# Altium project STM32F103C8T6.PrjPcb
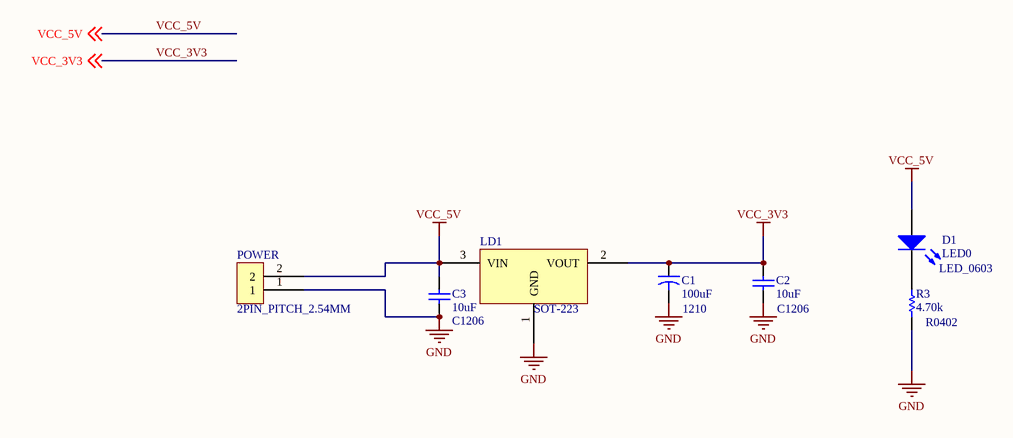
[diagram p0: 01 POWER.SchDoc]
3 sheets, 48 parts. Net scope: global (net labels, ports and power ports of the same name join across sheets).
Board file: STM32FC8T6.PcbDoc
Sheets:
  01 POWER.SchDoc
  02 CPU STM32F103C8T6.SchDoc
  04 MP_SIGNAL.SchDoc

## Sheet 01 POWER.SchDoc
size A4

### Parts
C1  100uF  [1210]
C2  10uF  [C1206]
C3  10uF  [C1206]
D1  LED0  [LED_0603]
LD1  SOT-223  [LD1117S33TR]
POWER  2PIN_PITCH_2.54MM  [2PIN_PITCH_2.54MM]
R3  4.70k  [R0402]

### Nets
GND: C1.2 C2.1 C3.1 LD1.1(GND) POWER.1 R3.2
VCC_3V3: C1.1 C2.2 LD1.2(VOUT) ; off-sheet VCC_3V3
VCC_5V: C3.2 D1.1(A) LD1.3(VIN) POWER.2 ; off-sheet VCC_5V
NetD1_2: D1.2(K) R3.1

### Library data of the parts
C1 = Cap2: Capacitor; Value: 100pF; Published: 23-Sep-2002; PackageReference: CAPR5-4X5; Publisher: Altium Limited; PackageDescription: Capacitor; 2 Leads
C2 = Cap: Capacitor; Value: 100pF; Published: 8-Jun-2000; LatestRevisionDate: 17-Jul-2002; LatestRevisionNote: Re-released for DXP Platform.; PackageReference: RAD-0.3; Publisher: Altium Limited; PackageDescription: Radial Cap, Thru-Hole; 2 Leads; 0.3 in Pin Spacing
C3 = Cap: Capacitor; Published: 8-Jun-2000; LatestRevisionDate: 17-Jul-2002; LatestRevisionNote: Re-released for DXP Platform.; PackageReference: C1206; Publisher: Altium Limited; PackageDescription: Radial Cap, Thru-Hole; 2 Leads; 0.3 in Pin Spacing
D1 = LED0: Typical INFRARED GaAs LED; Published: 8-Jun-2000; LatestRevisionDate: 08-Jul-2005; LatestRevisionNote: Mech Layer 1 removed.; PackageReference: LED-0; Publisher: Altium Limited; PackageDescription: LED; 2 Leads; footpriint: LED_0603
LD1 = LD1117S33TR
R3 = Res1: Resistor; Value: 1K; Published: 8-Jun-2000; LatestRevisionDate: 17-Jul-2002; LatestRevisionNote: Re-released for DXP Platform.; PackageReference: AXIAL-0.3; Publisher: Altium Limited; PackageDescription: Axial Device, Thru-Hole; 2 Leads; 0.3 in Pin Spacing

## Sheet 02 CPU STM32F103C8T6.SchDoc
size A4
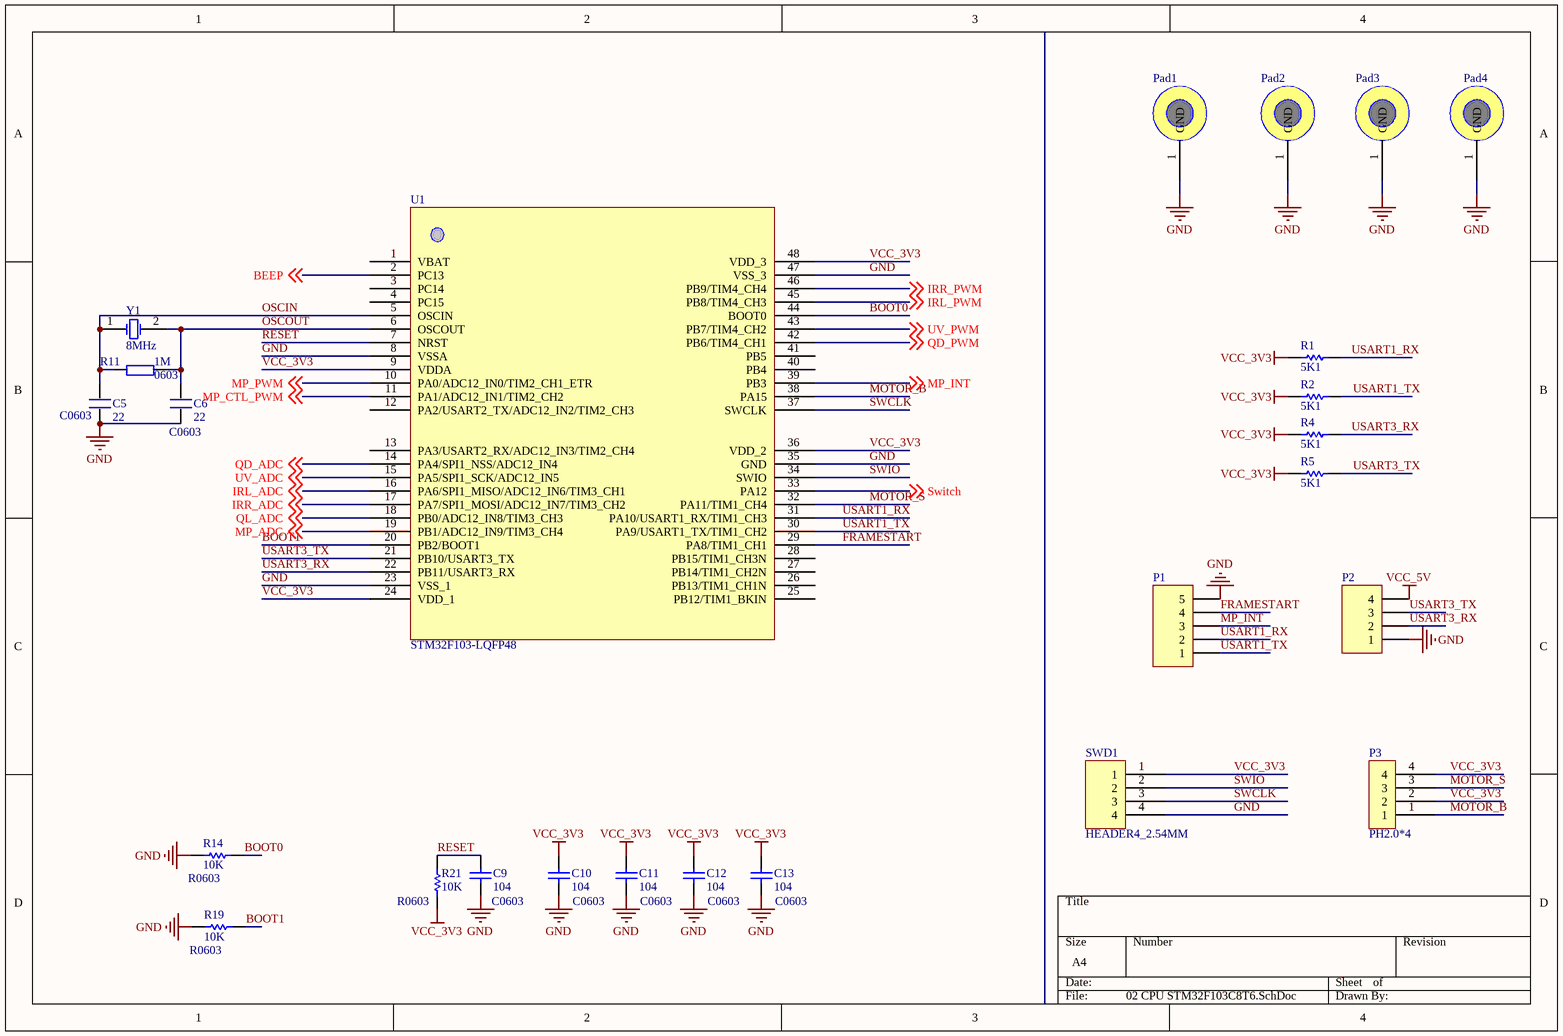
[diagram p1: 02 CPU STM32F103C8T6.SchDoc]

### Parts
C5  22  [C0603]
C6  22  [C0603]
C9  104  [C0603]
C10  104  [C0603]
C11  104  [C0603]
C12  104  [C0603]
C13  104  [C0603]
P1  (no value)  [PH2.0*5]
P2  (no value)  [PH2.0*4]
P3  PH2.0*4  [PH2.0*4]
Pad1  PAD_3.3(6.8)  [PAD_3.3(6.8)]  (value not drawn)
Pad2  PAD_3.3(6.8)  [PAD_3.3(6.8)]  (value not drawn)
Pad3  PAD_3.3(6.8)  [PAD_3.3(6.8)]  (value not drawn)
Pad4  PAD_3.3(6.8)  [PAD_3.3(6.8)]  (value not drawn)
R1  5K1  [R0603]
R2  5K1  [R0603]
R4  5K1  [R0603]
R5  5K1  [R0603]
R11  1M  footprint: 0603  [R0603]
R14  10K  [R0603]
R19  10K  [R0603]
R21  10K  [R0603]
SWD1  HEADER4_2.54MM  [HEADER4_2.54MM]
U1  STM32F103-LQFP48  [STM32F103_48P]
Y1  8MHz  [XTAL8M]

### Nets
GND: C5.1 C6.1 C9.2 C10.2 C11.2 C12.2 C13.2 P1.5 P2.1 Pad1.1(GND) Pad2.1(GND) Pad3.1(GND) Pad4.1(GND) R14.1 R19.1 SWD1.4 U1.8(VSSA) U1.23(VSS_1) U1.35(GND) U1.47(VSS_3)
VCC_3V3: C10.1 C11.1 C12.1 C13.1 P3.2 P3.4 R1.1 R2.1 R4.1 R5.1 R21.1 SWD1.1 U1.9(VDDA) U1.24(VDD_1) U1.36(VDD_2) U1.48(VDD_3)
VCC_5V: P2.4
BEEP: U1.2(PC13) ; off-sheet BEEP
BOOT0: R14.2 U1.44(BOOT0)
BOOT1: R19.2 U1.20(PB2/BOOT1)
FRAMESTART: P1.4 U1.29(PA8/TIM1_CH1)
IRL_ADC: U1.16(PA6/SPI1_MISO/ADC12_IN6/TIM3_CH1) ; off-sheet IRL_ADC
IRL_PWM: U1.45(PB8/TIM4_CH3) ; off-sheet IRL_PWM
IRR_ADC: U1.17(PA7/SPI1_MOSI/ADC12_IN7/TIM3_CH2) ; off-sheet IRR_ADC
IRR_PWM: U1.46(PB9/TIM4_CH4) ; off-sheet IRR_PWM
MOTOR_B: P3.1 U1.38(PA15)
MOTOR_S: P3.3 U1.32(PA11/TIM1_CH4)
MP_ADC: U1.19(PB1/ADC12_IN9/TIM3_CH4) ; off-sheet MP_ADC
MP_CTL_PWM: U1.11(PA1/ADC12_IN1/TIM2_CH2) ; off-sheet MP_CTL_PWM
MP_INT: P1.3 U1.39(PB3) ; off-sheet MP_INT
MP_PWM: U1.10(PA0/ADC12_IN0/TIM2_CH1_ETR) ; off-sheet MP_PWM
OSCIN: C5.2 R11.1 U1.5(OSCIN) Y1.1(OSC1)
OSCOUT: C6.2 R11.2 U1.6(OSCOUT) Y1.2(OSC2)
QD_ADC: U1.14(PA4/SPI1_NSS/ADC12_IN4) ; off-sheet QD_ADC
QD_PWM: U1.42(PB6/TIM4_CH1) ; off-sheet QD_PWM
QL_ADC: U1.18(PB0/ADC12_IN8/TIM3_CH3) ; off-sheet QL_ADC
RESET: C9.1 R21.2 U1.7(NRST)
SWCLK: SWD1.3 U1.37(SWCLK)
SWIO: SWD1.2 U1.34(SWIO)
Switch: U1.33(PA12) ; off-sheet Switch
USART1_RX: P1.2 R1.2 U1.31(PA10/USART1_RX/TIM1_CH3)
USART1_TX: P1.1 R2.2 U1.30(PA9/USART1_TX/TIM1_CH2)
USART3_RX: P2.2 R4.2 U1.22(PB11/USART3_RX)
USART3_TX: P2.3 R5.2 U1.21(PB10/USART3_TX)
UV_ADC: U1.15(PA5/SPI1_SCK/ADC12_IN5) ; off-sheet UV_ADC
UV_PWM: U1.43(PB7/TIM4_CH2) ; off-sheet UV_PWM

Not connected (* = marked no-connect by the designer): U1 1(VBAT) 3(PC14) 4(PC15) 12(PA2/USART2_TX/ADC12_IN2/TIM2_CH3) 13(PA3/USART2_RX/ADC12_IN3/TIM2_CH4) 25(PB12/TIM1_BKIN) 26(PB13/TIM1_CH1N) 27(PB14/TIM1_CH2N) 28(PB15/TIM1_CH3N) 40(PB4) 41(PB5)

### Library data of the parts
C5 C6 = C
C9 = Cap: Capacitor; Value: 100pF; Published: 8-Jun-2000; LatestRevisionDate: 17-Jul-2002; LatestRevisionNote: Re-released for DXP Platform.; PackageReference: RAD-0.3; Publisher: Altium Limited
C10-C13 = Cap: Capacitor; Manufacturer: Generic Components; Class: Passive; Value: 105; Published: 08/06/2000; Publisher: Altium Hobart Technology Centre; SubClass: Capacitor
P1 = Header 5: Header, 5-Pin; LatestRevisionDate: 17-Jul-2002; LatestRevisionNote: Re-released for DXP Platform.; Publisher: Altium Limited
P2 = Header 4: Header, 4-Pin; LatestRevisionDate: 17-Jul-2002; LatestRevisionNote: Re-released for DXP Platform.; Publisher: Altium Limited
R1 R2 R4 R5 = Res1: Resistor; Manufacturer: Generic Components; Class: Passive; Value: 5.1K; Published: 08/06/2000; Publisher: Altium Hobart Technology Centre; SubClass: Resistor
R11 = R
R14 R19 R21 = Res Semi: Semiconductor Resistor; Value: 1K; Published: 8-Jun-2000; LatestRevisionDate: 17-Jul-2002; LatestRevisionNote: Re-released for DXP Platform.; PackageReference: AXIAL-0.5; Publisher: Altium Limited
Y1 = XTAL: Crystal Oscillator; Published: 8-Jun-2000; LatestRevisionDate: 17-Jul-2002; LatestRevisionNote: Re-released for DXP Platform.; Publisher: Altium Limited

## Sheet 04 MP_SIGNAL.SchDoc
size A4
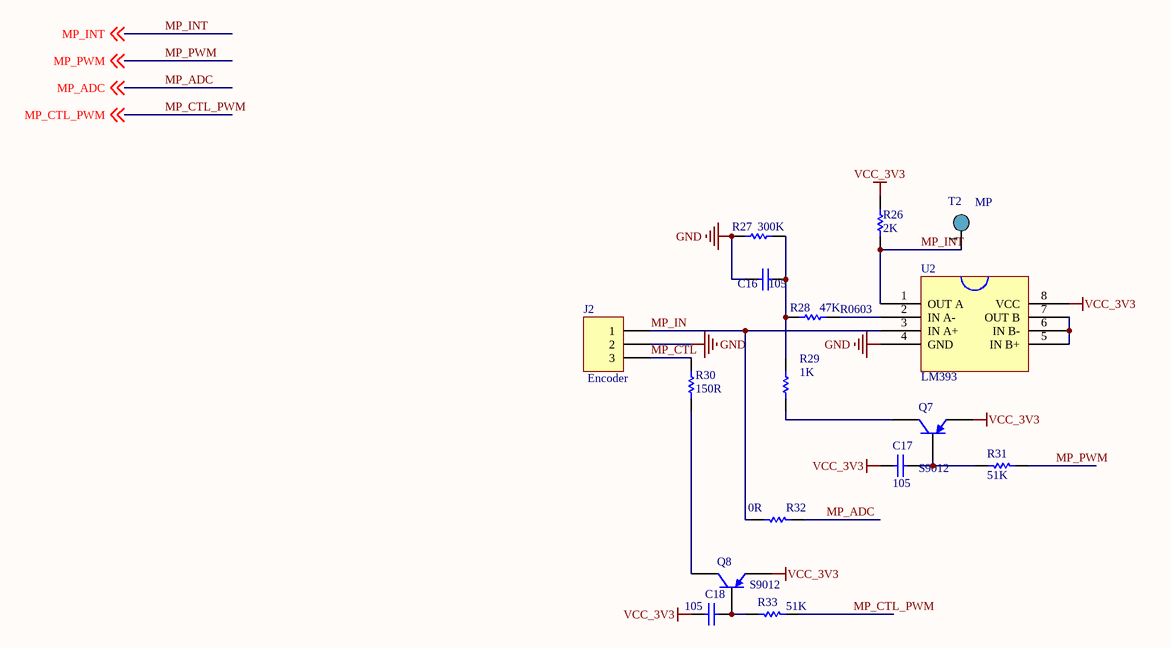
[diagram p2: 04 MP_SIGNAL.SchDoc]

### Parts
C16  105  [R0603]
C17  105  [C0603]
C18  105  [C0603]
J2  Encoder  [PH2.0*3]
Q7  S9012  [PNP-SOT-23]
Q8  S9012  [PNP-SOT-23]
R26  2K  [R0603]
R27  300K  [R0603]
R28  47K  [R0603]
R29  1K  [R0603]
R30  150R  [R0603]
R31  51K  [R0603]
R32  0R  [R0603]
R33  51K  [R0603]
T2  MP  [测试点]
U2  LM393  [LM393]

### Nets
GND: C16.1 J2.2 R27.1 U2.4(GND)
VCC_3V3: C17.1 C18.2 Q7.1(E) Q8.1(E) R26.1 U2.8(VCC)
MP_ADC: R32.1 ; off-sheet MP_ADC
MP_CTL: J2.3 R30.2
MP_CTL_PWM: R33.1 ; off-sheet MP_CTL_PWM
MP_IN: J2.1 R32.2 U2.3(IN_A+)
MP_INT: R26.2 T2.1 U2.1(OUT_A) ; off-sheet MP_INT
MP_PWM: R31.1 ; off-sheet MP_PWM
NetC16_2: C16.2 R27.2 R28.1 R29.1
NetC17_2: C17.2 Q7.2(B) R31.2
NetC18_1: C18.1 Q8.2(B) R33.2
NetQ7_3: Q7.3(C) R29.2
NetQ8_3: Q8.3(C) R30.1
NetR28_2: R28.2 U2.2(IN_A-)
NetU2_5: U2.5(IN_B+) U2.6(IN_B-) U2.7(OUT_B)

### Library data of the parts
C16-C18 = Cap: Capacitor; Manufacturer: Generic Components; Class: Passive; Published: 08/06/2000; Publisher: Altium Hobart Technology Centre; SubClass: Capacitor; Value: 105
J2 = Header 3: Header, 3-Pin; Manufacturer: Generic Components; Class: Connector
Q7 Q8 = 2N3906: PNP General Purpose Amplifier; Published: 8-Jun-2000; LatestRevisionDate: 15-Jan-2003; LatestRevisionNote: PCB Footprint 'BCY-W3/D4.7' replaced; DatasheetDocument: 1997; PackageDocument: Sep-1998; PackageReference: TO-92A; Publisher: Altium Limited; Code_JEDEC: TO-92A
R26-R30 = Res1: as R1 on sheet 02 CPU STM32F103C8T6; Published: 08/06/2000; Publisher: Altium Hobart Technology Centre; SubClass: Resistor
R31 R33 = Res1: Resistor; Manufacturer: Generic Components; Class: Passive; Published: 08/06/2000; Publisher: Altium Hobart Technology Centre; SubClass: Resistor; Value: 51K
R32 = Res1: Resistor; Manufacturer: Generic Components; Class: Passive; Value: 51K; Published: 08/06/2000; Publisher: Altium Hobart Technology Centre; SubClass: Resistor
T2 = DIAN

## Nets that join several sheets
GND: 01 POWER (6 pins), 02 CPU STM32F103C8T6 (20 pins), 04 MP_SIGNAL (C16.1 J2.2 R27.1 U2.4)
VCC_3V3: 01 POWER (C1.1 C2.2 LD1.2), 02 CPU STM32F103C8T6 (16 pins), 04 MP_SIGNAL (6 pins)
VCC_5V: 01 POWER (C3.2 D1.1 LD1.3 POWER.2), 02 CPU STM32F103C8T6 (P2.4)
MP_ADC: 02 CPU STM32F103C8T6 (U1.19), 04 MP_SIGNAL (R32.1)
MP_CTL_PWM: 02 CPU STM32F103C8T6 (U1.11), 04 MP_SIGNAL (R33.1)
MP_INT: 02 CPU STM32F103C8T6 (P1.3 U1.39), 04 MP_SIGNAL (R26.2 T2.1 U2.1)
MP_PWM: 02 CPU STM32F103C8T6 (U1.10), 04 MP_SIGNAL (R31.1)